# EAGLE design Motor Driver (EAGLE 5.10)
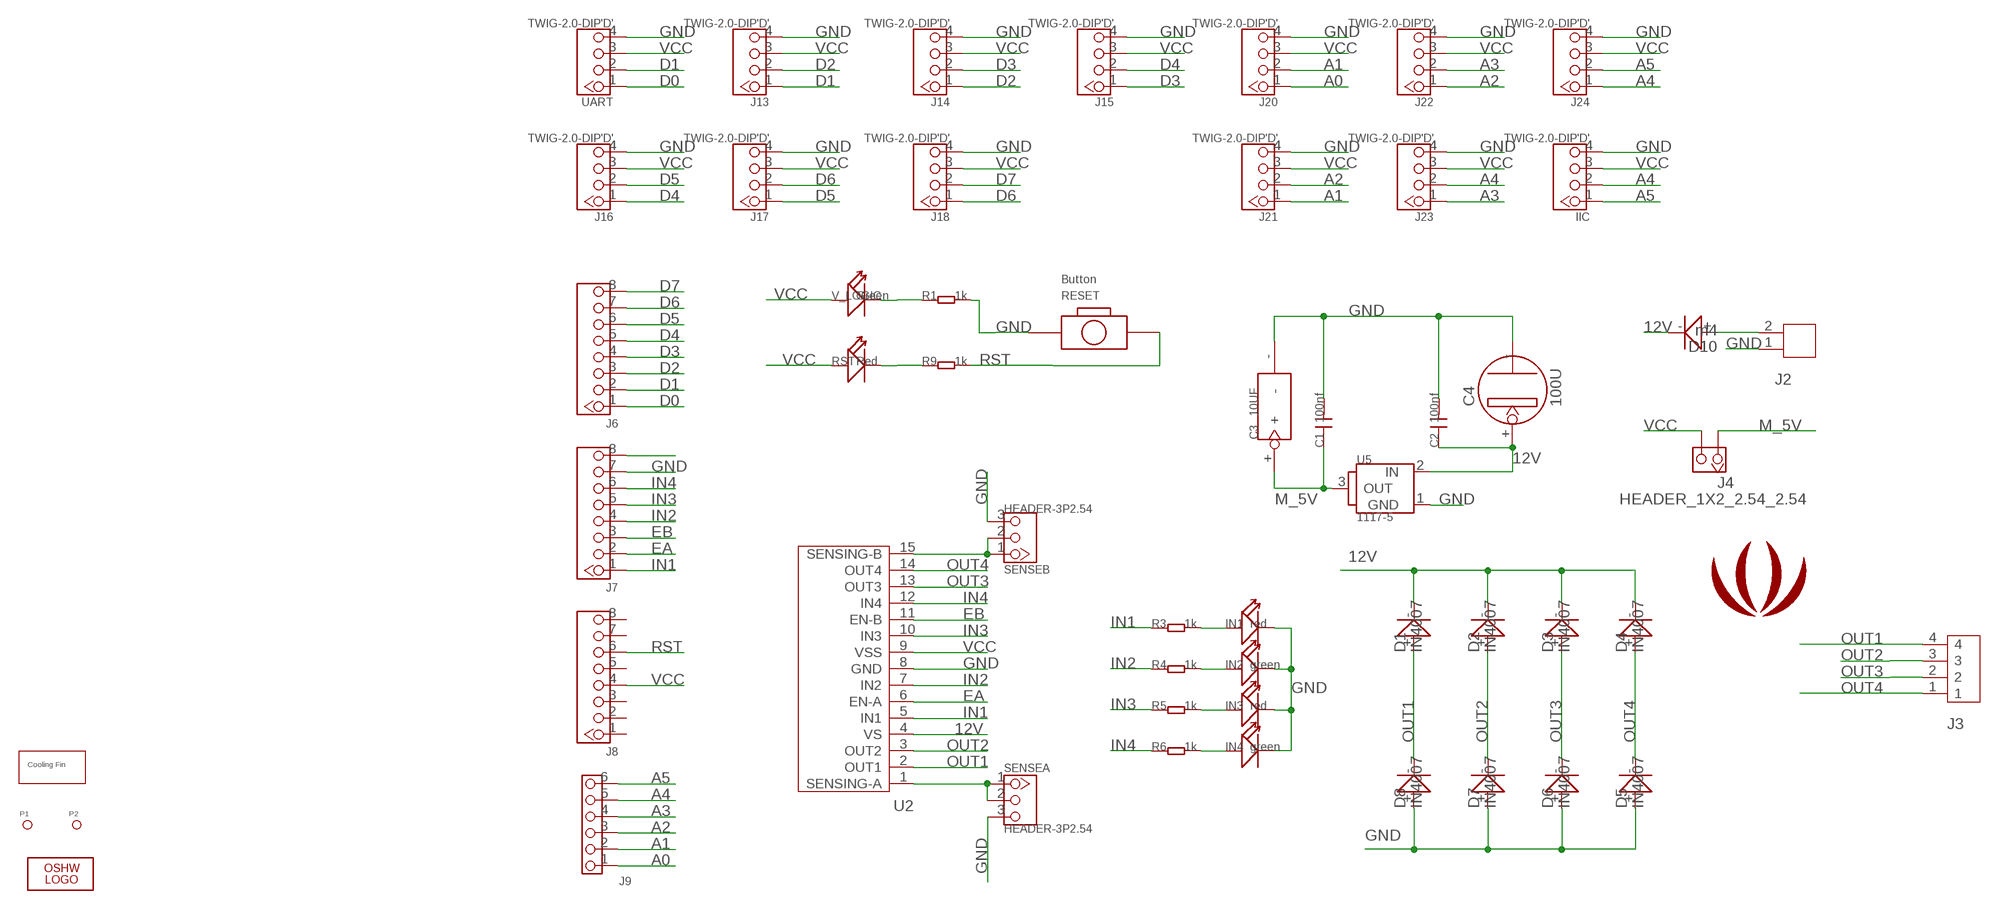
[diagram p0: schematic, sheet 1]

## Parts
C1  100nf  006-C30*35  [0603_S]
C2  100nf  006-C30*35  [0603_S]
C3  10UF  C_TAN_B  [C_TAN_3X3.5]
C4  100U  PANASONIC_D260  [SANYO-OSCON_SMD_C6]
D1  IN4007  010-D2010  [D2010]
D2  IN4007  010-D2010  [D2010]
D3  IN4007  010-D2010  [D2010]
D4  IN4007  010-D2010  [D2010]
D5  IN4007  010-D2010  [D2010]
D6  IN4007  010-D2010  [D2010]
D7  IN4007  010-D2010  [D2010]
D8  IN4007  010-D2010  [D2010]
D10  m4  010-D2010  [D2010]
IIC  TWIG-2.0-DIP'D'  [2.0_1X4_90]
IN1  red  007-LED0603  [D0603]
IN2  green  007-LED0603  [D0603]
IN3  red  007-LED0603  [D0603]
IN4  green  007-LED0603  [D0603]
J2  JST-2P-LEADED'3.36'  [2P-3.36-LEADED-7X7]
J3  JST-4P-3.36-LEADED  [4P-3.36-LEADED-7X14]
J4  HEADER_1X2_2.54_2.54  [65*35]
J6  HEADER-8PSMD  [SMD_8PIN_2.54]
J7  HEADER-8PSMD  [SMD_8PIN_2.54]
J8  HEADER-8PSMD  [SMD_8PIN_2.54]
J9  HEADER-6PSMD  [2.54_6P_SMD]
J13  TWIG-2.0-DIP'D'  [2.0_1X4_90]
J14  TWIG-2.0-DIP'D'  [2.0_1X4_90]
J15  TWIG-2.0-DIP'D'  [2.0_1X4_90]
J16  TWIG-2.0-DIP'D'  [2.0_1X4_90]
J17  TWIG-2.0-DIP'D'  [2.0_1X4_90]
J18  TWIG-2.0-DIP'D'  [2.0_1X4_90]
J20  TWIG-2.0-DIP'D'  [2.0_1X4_90]
J21  TWIG-2.0-DIP'D'  [2.0_1X4_90]
J22  TWIG-2.0-DIP'D'  [2.0_1X4_90]
J23  TWIG-2.0-DIP'D'  [2.0_1X4_90]
J24  TWIG-2.0-DIP'D'  [2.0_1X4_90]
LOGO2  LOGO-OSHW-FILLX0200-NT  [OSHW_FILLX200_NOTEXT]
P1  PAD-MARK  [ROUND-MARK-0.635]
P2  PAD-MARK  [ROUND-MARK-0.635]
R1  1k  005-R0603  [0603-1]
R3  1k  005-R0603  [0603-1]
R4  1k  005-R0603  [0603-1]
R5  1k  005-R0603  [0603-1]
R6  1k  005-R0603  [0603-1]
R9  1k  005-R0603  [0603-1]
RESET  Button  BOTTON-2P-DIP  [2P-LEADED-90-3.56X7.62]
RST  Red  007-LED0603  [D0603]
SENSEA  HEADER-3P2.54  [2.54_1X3P]
SENSEB  HEADER-3P2.54  [2.54_1X3P]
U1  COOLING-FIN  [COOLING-FIN-17X23.8]
U2  L298N-  [MULTIWATT15]
U5  1117-5  [TO252]
U$1  LOGO-SEEEDSTUDIO-SILK  [LOGO_SILK]
UART  TWIG-2.0-DIP'D'  [2.0_1X4_90]
V_LOGIC  Green  007-LED0603  [D0603]

## Nets
12V: C2.1 C4.+ D1.- D2.- D3.- D4.- D10.- U2.4(VS) U5.2(IN)
A0: J9.1 J20.1
A1: J9.2 J20.2 J21.1
A2: J9.3 J21.2 J22.1
A3: J9.4 J22.2 J23.1
A4: IIC.2 J9.5 J23.2 J24.1
A5: IIC.1 J9.6 J24.2
D0: J6.1 UART.1
D1: J6.2 J13.1 UART.2
D2: J6.3 J13.2 J14.1
D3: J6.4 J14.2 J15.1
D4: J6.5 J15.2 J16.1
D5: J6.6 J16.2 J17.1
D6: J6.7 J17.2 J18.1
D7: J6.8 J18.2
EA: J7.2 U2.6(EN-A)
EB: J7.3 U2.11(EN-B)
GND: C1.2 C2.2 C3.- C4.- D5.+ D6.+ D7.+ D8.+ IIC.4 IN1.- IN2.- IN3.- IN4.- J2.1 J7.7 J13.4 J14.4 J15.4 J16.4 J17.4 J18.4 J20.4 J21.4 J22.4 J23.4 J24.4 R1.2 RESET.P$1 SENSEA.3 SENSEB.3 U2.8(GND) U5.1(GND) UART.4
IN1: J7.1 R3.1 U2.5(IN1)
IN2: J7.4 R4.1 U2.7(IN2)
IN3: J7.5 R5.1 U2.10(IN3)
IN4: J7.6 R6.1 U2.12(IN4)
M_5V: C1.1 C3.+ J4.1 U5.3(OUT)
N$1: IN3.+ R5.2
N$3: R1.1 V_LOGIC.-
N$4: SENSEA.1 SENSEA.2 U2.1(SENSING-A)
N$6: D10.+ J2.2
N$10: R9.1 RST.-
N$14: IN1.+ R3.2
N$15: IN2.+ R4.2
N$16: J7.8
N$17: IN4.+ R6.2
N$20: SENSEB.1 SENSEB.2 U2.15(SENSING-B)
OUT1: D1.+ D8.- J3.4 U2.2(OUT1)
OUT2: D2.+ D7.- J3.3 U2.3(OUT2)
OUT3: D3.+ D6.- J3.2 U2.13(OUT3)
OUT4: D4.+ D5.- J3.1 U2.14(OUT4)
RST: J8.6 R9.2 RESET.P$2
VCC: IIC.3 J4.2 J8.4 J13.3 J14.3 J15.3 J16.3 J17.3 J18.3 J20.3 J21.3 J22.3 J23.3 J24.3 RST.+ U2.9(VSS) UART.3 V_LOGIC.+
Unconnected: J8.1 J8.2 J8.3 J8.5 J8.7 J8.8

## Library data of the parts
C1 C2 = Discrete:006-C*: Ceramic Capacitors
C3 = CPT_SMD:C_TAN
C4 = CPT_SMD:PANASONIC_D
D1-D8 D10 = Discrete:010-D*
IIC J13-J18 J20-J24 UART = Connector:TWIG-2.0-DIP
IN1-IN4 RST V_LOGIC = Discrete:007-LED*
J2 = Connector:JST-2P-LEADED
J3 = Connector:JST-4P-3.36-LEADED
J4 = Connector:HEADER_1X2_2.54
J6-J8 = Connector:HEADER-8P
J9 = Connector:HEADER-6P
LOGO2 = Logo:LOGO-OSHW-FILL
P1 P2 = Discreter:PAD-MARK
R1 R3-R6 R9 = Discrete:005-R*
RESET = Discreter:BOTTON-2P
SENSEA SENSEB = Connector:HEADER-3P
U1 = Module:COOLING-FIN
U2 = IC:L298N
U5 = ICs_v54:1117-5
U$1 = Logo:LOGO-SEEEDSTUDIO

## Board
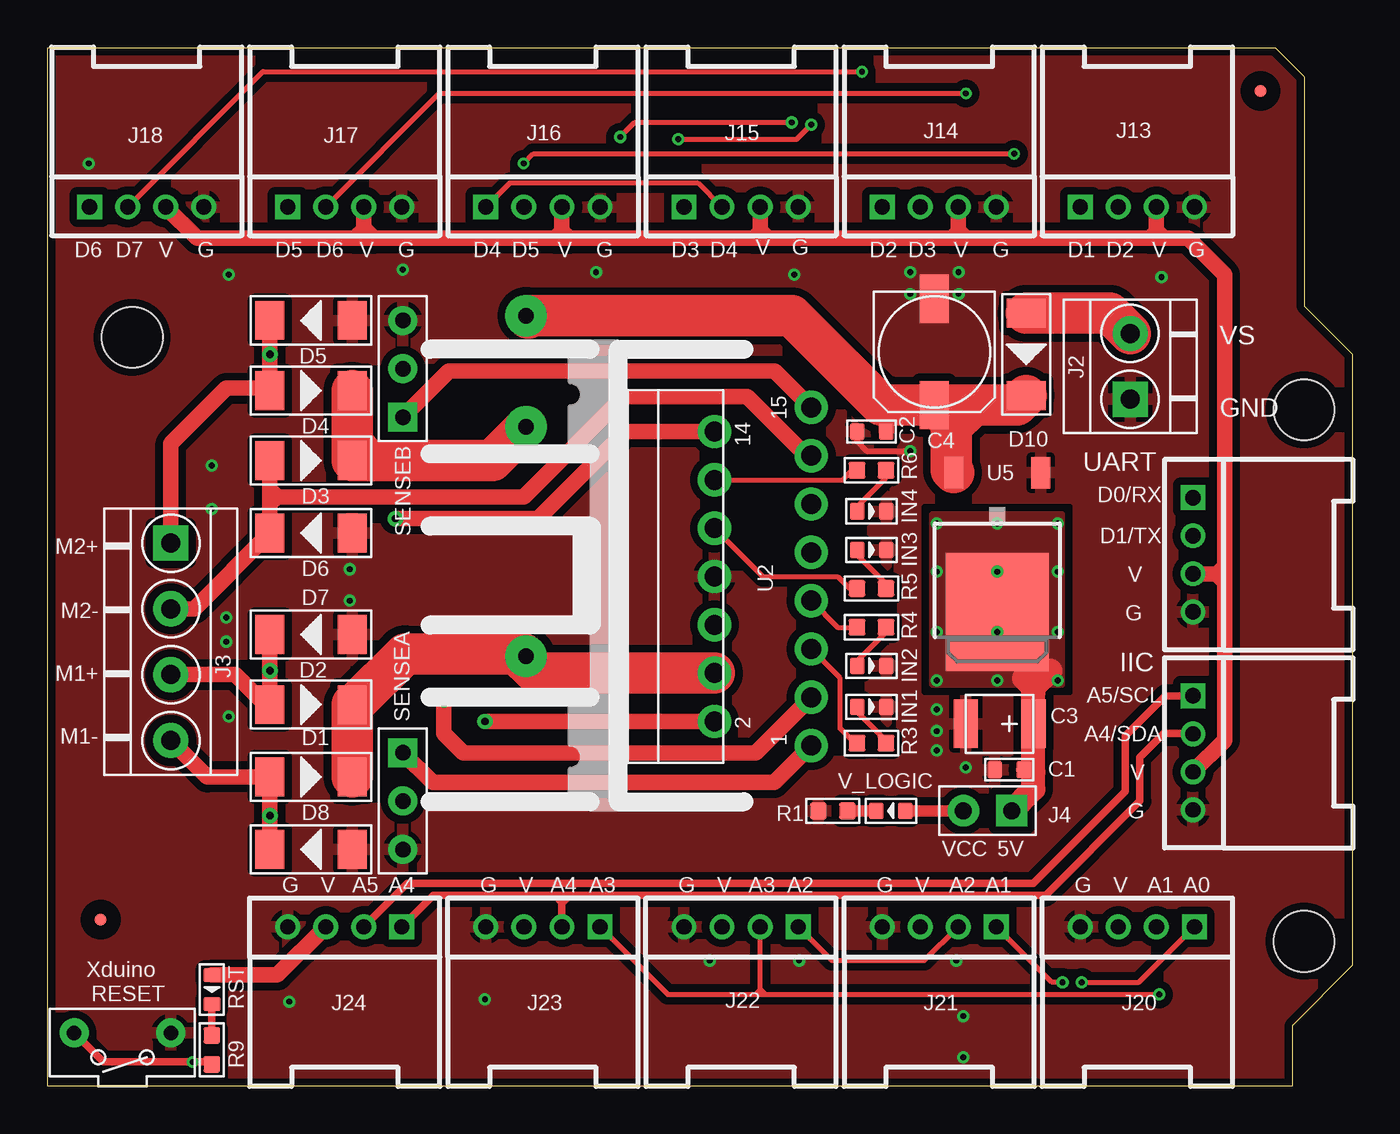
[diagram p1: board, top side]
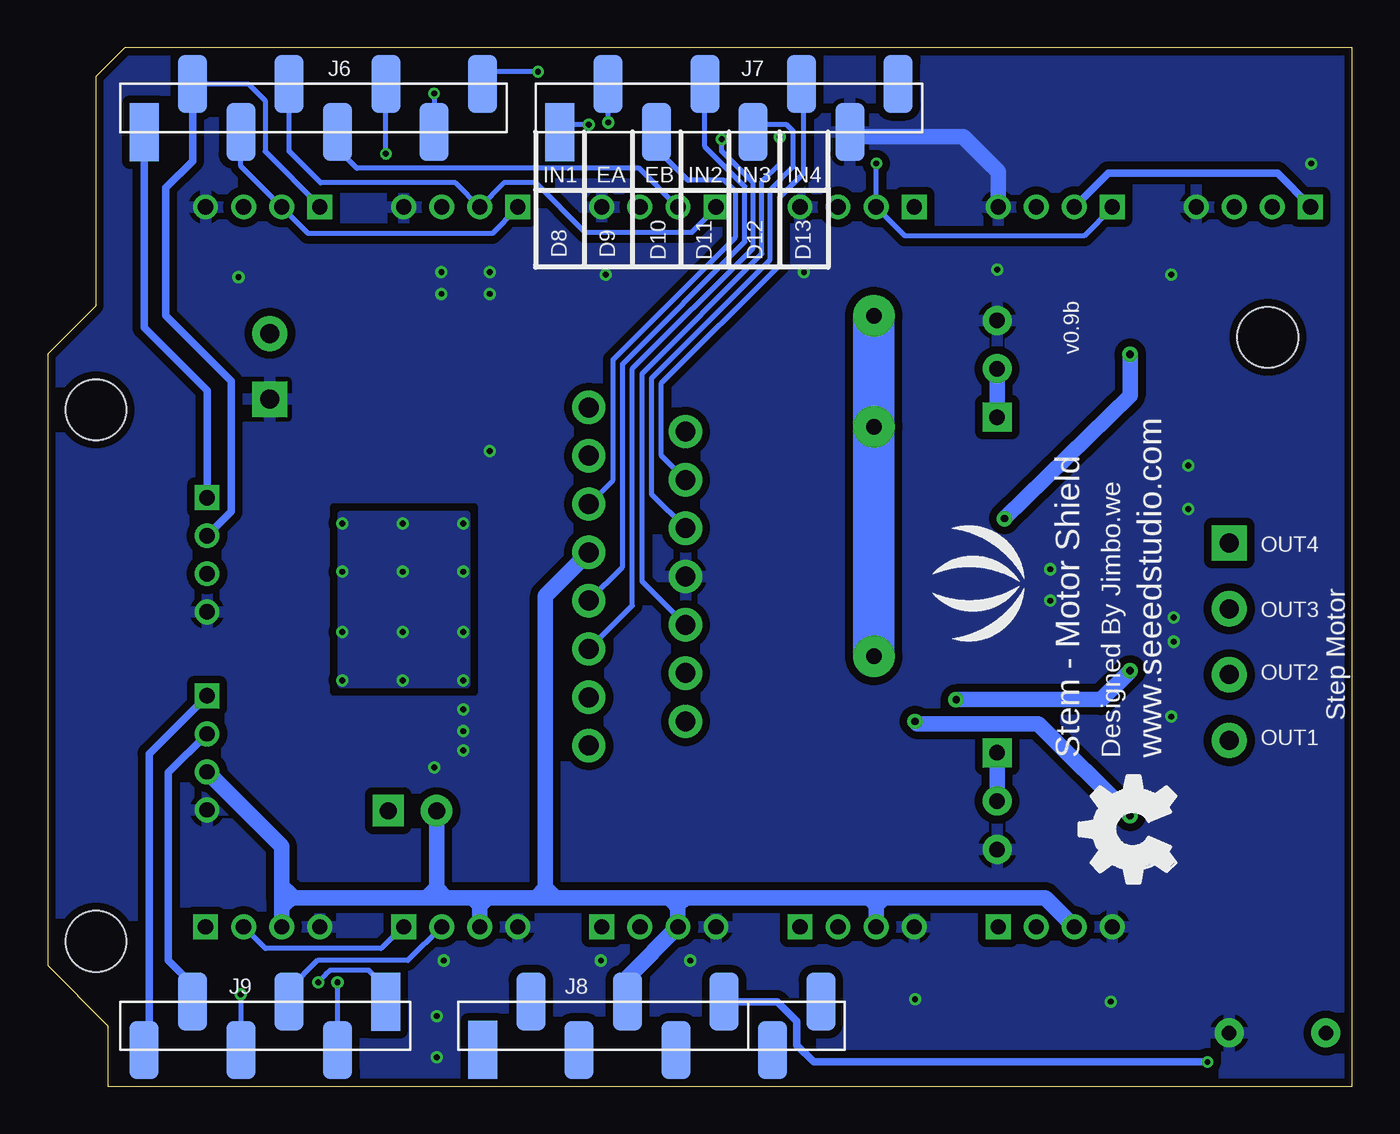
[diagram p2: board, bottom side, seen from below]

Size 68.58 x 54.61 mm. Coordinates in mm from the lower left corner, seen from the top.
Outline: 68.58,6.35 65.41,3.17 65.41,0 0,0 0,54.61 64.52,54.61 66.04,53.09 66.04,41.02 68.58,38.48 68.58,6.35
Copper layers (1*16): Top 0.035mm / dielectric 1.5mm / Bottom 0.035mm
Design rules "SeeedStudio_rule_no_angle_090911": minimum track width 6mil, minimum drill 12mil, track to track 6mil, track to pad 6mil, pad to pad 6mil, via to via 6mil, smd to smd 0mil, copper to edge 10mil, drill to drill 10mil, minimum pad ring 10mil, minimum via ring 6mil, stop-mask expansion 2mil, vias tented up to drill 100mil, thermal gap 10mil
Holes 3.2 mm at 66.04,35.56 66.04,7.62 4.45,39.37

### Footprints (pad centres in the part's own frame; a part is rotated, then mirrored left to right if it is on the bottom)
0603_S = smd 0.762 x 0.889: 1 -0.762,0; 2 0.762,0
C_TAN_3X3.5 = smd 2.54 x 1.27: + 0,1.778; - 0,-1.778
SANYO-OSCON_SMD_C6 = smd 2.54 x 1.524: + 2.794,0; - -2.794,0
D2010 = smd 1.524 x 2.032: + -2.159,0; - 2.159,0
2.0_1X4_90 = drill 0.8 pad 1.27 square: 1 -3,0 | drill 0.8 pad 1.27 round: 2 -1,0; 3 1,0; 4 3,0
D0603 = smd 0.762 x 0.889: + -0.762,0; - 0.762,0
2P-3.36-LEADED-7X7 = drill 1 pad 1.85 square: 1 -1.73,0 | drill 1 pad 1.85 round: 2 1.73,0
4P-3.36-LEADED-7X14 = drill 1 pad 1.85 square: 1 -5.19,0 | drill 1 pad 1.85 round: 2 -1.73,0; 3 1.73,0; 4 5.19,0
65*35 = drill 0.889 pad 1.651 square: 1 0,1.27 | drill 0.889 pad 1.651 round: 2 0,-1.27
SMD_8PIN_2.54 = smd 3.048 x 1.524: 1 -1.27,8.89; 2 1.27,6.35; 3 -1.27,3.81; 4 1.27,1.27; 5 -1.27,-1.27; 6 1.27,-3.81; 7 -1.27,-6.35; 8 1.27,-8.89
2.54_6P_SMD = smd 3.048 x 1.524: 1 -1.27,6.35; 2 1.27,3.81; 3 -1.27,1.27; 4 1.27,-1.27; 5 -1.27,-3.81; 6 1.27,-6.35
ROUND-MARK-0.635 = smd 0.635 x 0.635: P$1 0,0
0603-1 = smd 0.889 x 0.889: 1 -0.762,0; 2 0.762,0
2P-LEADED-90-3.56X7.62 = drill 0.762 pad 1.524 round: P$1 0,2.54; P$2 0,-2.54
2.54_1X3P = drill 0.813 pad 1.524 square: 1 0,2.54 | drill 0.813 pad 1.524 round: 2 0,0; 3 0,-2.54
MULTIWATT15 = drill 1.05 pad 1.75 round: 1 -8.89,0; 2 -7.62,5.08; 3 -6.35,0; 4 -5.08,5.08; 5 -3.81,0; 6 -2.54,5.08; 7 -1.27,0; 8 0,5.08; 9 1.27,0; 10 2.54,5.08; 11 3.81,0; 12 5.08,5.08; 13 6.35,0; 14 7.62,5.08; 15 8.89,0
TO252 = smd 1.016 x 1.651: 1 -2.286,-4.826; 2 2.286,-4.826 | smd 5.4 x 6.2: 3 0,2.5

### Placement (x,y rotation side)
C1  50.55,16.64 180 top
C2  43.31,34.42 180 top
C3  50.04,19.05 270 top
C4  46.61,38.61 270 top
D1  13.84,16.26 0 top
D2  13.84,20.07 0 top
D3  13.84,32.89 0 top
D4  13.84,36.58 0 top
D5  13.84,40.26 180 top
D6  13.84,29.08 180 top
D7  13.84,23.75 180 top
D8  13.84,12.45 180 top
D10  51.44,38.48 270 top
IIC  60.2,17.53 270 top
IN1  43.31,19.94 0 top
IN2  43.31,22.1 0 top
IN3  43.31,28.19 0 top
IN4  43.31,30.23 0 top
J2  56.9,37.85 90 top
J3  6.48,23.37 270 top
J4  49.4,14.48 270 top
J6  54.61,51.44 90 bottom
J7  32.77,51.44 90 bottom
J8  36.83,3.17 90 bottom
J9  57.15,3.17 270 bottom
J13  57.28,46.23 0 top
J14  46.86,46.23 0 top
J15  36.45,46.23 0 top
J16  26.04,46.23 0 top
J17  15.62,46.23 0 top
J18  5.21,46.23 0 top
J20  57.28,8.38 180 top
J21  46.86,8.38 180 top
J22  36.45,8.38 180 top
J23  26.04,8.38 180 top
J24  15.62,8.38 180 top
LOGO2  9.27,10.67 90 bottom
P1  63.75,52.32 0 top
P2  2.79,8.76 0 top
R1  41.27,14.48 180 top
R3  43.31,18.03 0 top
R4  43.31,24.13 0 top
R5  43.31,26.16 0 top
R6  43.31,32.38 0 top
R9  8.64,1.91 270 top
RESET  3.94,2.79 270 top
RST  8.64,5.08 270 top
SENSEA  18.67,14.99 0 top
SENSEB  18.67,37.72 180 top
U1  30,26.85 90 top
U2  40.13,26.8 90 top
U5  49.91,27.43 180 top
U$1  18.92,26.42 90 bottom
UART  60.2,27.94 270 top
V_LOGIC  44.32,14.48 180 top

### Tracks (layer width: path | path; a pad name or v marks a point on that pad's centre or on a via)
12V  (via drill 0.81 pad 2.18)
  Top 0.813: C2.1 44.07,35.56 44.32,35.81
  Top 2.184: D4.- D3.- 16.89,32.89 | D1.- D2.- 16.13,20.07 18.8,22.73 24.64,22.73 | 24.64,22.73 25.02,22.73 v25.15,22.61 | U2.4 25.65,21.72 24.64,22.73 | v25.15,34.67 23.37,32.89 17.14,32.89 16.89,32.89 | 25.27,40.39 v25.15,40.51 39.12,40.51 43.81,35.81 44.32,35.81 C4.+ | 47.5,34.67 47.5,34.92 C4.+ | C4.+ 50.93,35.81 D10.- | U5.2 47.5,32.38 47.5,34.67 | 47.5,34.67 48.51,35.69 | 16.89,32.89 16,33.78
  Bottom 2.184: v25.15,40.51 v25.15,34.67 v25.15,22.61
A0  (via drill 0.3 pad 0.64)
  Top 0.254: v54.36,5.46 57.36,5.46 J20.1
  Bottom 0.254: J9.1 50.8,5.21 51.69,6.1 53.72,6.1 53.98,5.84 v54.36,5.46
A1  (via drill 0.3 pad 0.64)
  Top 0.254: v53.34,5.46 52.78,5.46 J21.1
  Bottom 0.254: J21.1 49.91,8.38 51.05,7.24 57.13,7.24 J20.2 | J9.2 v53.34,5.46
A2
  Top 0.254: J22.1 41.23,6.6 46.09,6.6 J21.2
  Bottom 0.254: J9.3 55.88,5.12 54.4,6.6 49.64,6.6 J21.2
A3  (via drill 0.3 pad 0.64)
  Top 0.254: 37.21,4.83 32.59,4.83 J23.1 | 37.21,4.83 37.47,4.83 | 37.47,4.83 37.72,4.83 | 37.72,4.83 v58.42,4.83 | 37.45,5.06 37.45,4.84 37.47,4.83 | 37.45,5.06 J22.2 | 37.21,4.83 37.45,5.06 | 37.45,5.06 37.48,5.06 37.72,4.83
  Bottom 0.254: v58.42,4.83 J9.4
A4
  Top 0.406: 26.67,10.03 20.27,10.03 J24.1 | 26.67,10.03 26.92,10.03 | 27.04,9.67 27.04,9.92 26.92,10.03 | 26.92,10.03 27.43,10.03 | 27.43,10.03 51.7,10.03 52.45,10.03 57.28,14.86 57.4,14.99 57.4,17.27 58.67,18.54 60.18,18.54 IIC.2 | 27.04,9.67 J23.2 | 26.67,10.03 27.04,9.67 | 27.04,9.67 27.07,9.67 27.43,10.03
  Bottom 0.406: J9.5 60.96,5.33 62.23,6.6 62.23,16.49 IIC.2
A5
  Top 0.406: J24.2 18.91,10.67 50.34,10.67 51.82,10.67 56.64,15.49 56.64,18.41 58.55,20.32 58.75,20.53 IIC.1
  Bottom 0.406: J9.6 63.25,2.16 63.25,17.48 IIC.1
D0
  Bottom 0.406: J6.1 63.5,39.88 60.2,36.58 UART.1
D1
  Bottom 0.254: J13.1 54.28,46.28 57.15,49.15 57.15,51.82 58.04,52.7 J6.2
  Bottom 0.406: J6.2 60.96,48.64 62.36,47.24 62.36,40.51 58.93,37.08 58.93,30.21 UART.2
D2
  Bottom 0.254: J14.1 43.86,46.18 45.21,44.83 54.88,44.83 J13.2 58.42,48.37 J6.3
D3
  Bottom 0.254: J6.4 55.88,49.15 54.23,47.5 47.13,47.5 J14.2 44.59,47.5 42.93,47.5 40.31,44.88 34.74,44.88 33.45,46.18 J15.1
D4
  Top 0.254: J15.2 35.43,46.23 34.16,47.5 24.3,47.5 J16.1
  Bottom 0.254: J6.5 53.34,49.28 52.32,48.26 37.48,48.26 J15.2
D5  (via drill 0.3)
  Top 0.254: v50.8,49.02 25.53,49.02 v25.02,48.51
  Bottom 0.254: J17.1 12.62,46.18 14.1,44.7 23.51,44.7 J16.2 25.04,48.5 v25.02,48.51 | v50.8,49.02 J6.6
D6  (via drill 0.3)
  Top 0.254: J17.2 20.59,52.2 v48.26,52.2
  Bottom 0.254: v48.26,52.2 J6.7
  Bottom 0.406: J18.1 2.21,46.28 3.94,48.01 12.84,48.01 J17.2
D7  (via drill 0.3)
  Top 0.254: v42.8,53.34 11.32,53.34 J18.2
  Bottom 0.254: v42.8,53.34 45.09,53.34 J6.8
EA  (via drill 0.3 pad 0.64)
  Top 0.254: v30.1,49.91 30.86,50.67 v39.12,50.67
  Bottom 0.254: v39.12,50.67 J7.2 | U2.6 37.34,26.54 37.34,37.47 31.03,43.77 31.03,47.58 30.1,48.51 v30.1,49.91
EB
  Bottom 0.254: J7.3 36.58,49.28 34.92,47.62 33.02,47.62 32.42,47.02 32.42,44.65 38.86,38.21 38.86,31.88 U2.11
GND  (via drill 0.3 pad 0.64)
  Top 0.305: C2.2 42.55,33.91 43.05,33.4 v45.34,33.4
  Bottom 0.813: J17.4 18.62,48.09 20.45,49.91 26.16,49.91 J7.7
  other vias: 22.99,4.57 12.7,4.45 15.88,27.18 15.88,25.53 18.67,42.93 9.53,42.67 28.83,42.8 39.24,42.67 8.64,32.64 45.34,42.8 45.34,41.66 47.88,42.8 47.88,41.66 58.55,42.55 2.16,48.51 9.4,23.37 46.74,19.81 46.74,17.65 46.74,18.67 48.26,16.76 8.64,30.35 9.53,19.43 9.4,24.64 47.75,6.6 39.5,6.6 34.8,6.6 48.13,3.68 48.13,1.52
  pour Top (isolate 0.406, rank 6): -1.78,57.78 70.61,57.91 70.61,-2.41 -1.78,-2.54
  pour Bottom (isolate 0.406, rank 6): -1.78,57.78 70.61,57.78 70.61,-2.54 -1.78,-2.54
  pour Top (isolate 0.254, rank 2, no thermals): 44.96,43.18 48.39,43.18 48.39,39.88 44.96,39.88
IN1  (via drill 0.3 pad 0.64)
  Top 0.254: v33.15,49.78 39.37,49.78 v40.13,50.55 | R3.1 42.42,18.03 41.66,18.8 41.66,21.46 U2.5
  Bottom 0.254: U2.5 37.85,25.27 37.85,37.72 31.5,44.07 31.5,47.5 33.15,49.15 v33.15,49.78 | v40.13,50.55 41.27,50.55 J7.1 41.66,50.55
IN2
  Top 0.254: R4.1 41.53,24.13 U2.7
  Bottom 0.254: J7.4 34.04,49.4 31.93,47.3 31.93,44.4 38.35,37.97 38.35,27.3 U2.7
IN3
  Top 0.254: R5.1 42.16,26.16 41.53,26.8 37.59,26.8 U2.10
  Bottom 0.254: 31.5,49.4 J7.5 31.11,50.55 29.72,50.55 29.38,50.21 29.38,48.34 30.61,47.12 30.61,43.45 36.83,37.22 36.83,31.11 U2.10
IN4
  Top 0.254: R6.1 42.29,32.38 41.78,31.88 U2.12
  Bottom 0.254: J7.6 28.83,52.58 28.83,48.01 30.1,46.74 30.1,43.18 36.32,36.96 36.32,33.15 U2.12
M_5V  (via drill 0.3 pad 0.64)
  Top 0.813: v49.91,23.88 50.04,23.75 | C1.1 51.69,16.64 51.82,16.51
  Top 1.27: 51.82,20.95 51.82,21.97 v49.91,23.88 | J4.1 51.82,15.62 51.82,16.51 C3.+ 51.82,20.7 51.82,20.95 | 51.82,20.95 51.31,21.46 | 51.82,20.95 52.7,21.84
  other vias: 46.74,21.34 49.91,21.34 53.09,21.34 46.74,23.88 46.74,27.05 46.74,29.59 49.91,27.05 49.91,29.59 53.09,29.59 53.09,27.05 53.09,23.88
  pour Top (isolate 0.254, no thermals): 46.48,30.1 53.34,30.1 53.34,21.08 46.48,21.08
  pour Bottom (isolate 0.254, no thermals): 46.48,30.1 53.21,30.1 53.21,21.08 46.48,21.08
N$1
  Top 0.254: IN3.+ 42.55,27.94 44.07,26.42 R5.2
N$3
  Top 0.61: R1.1 V_LOGIC.-
N$4
  Top 0.813: U2.1 38.19,15.96 22.19,15.96 20.23,15.96 SENSEA.1
  Bottom 0.813: SENSEA.2 SENSEA.1
N$6
  Top 2.184: D10.+ 55.83,40.64 J2.2
N$10
  Top 0.406: R9.1 RST.-
N$14
  Top 0.254: 42.55,20.19 IN1.+ 42.55,19.68 44.07,18.16 R3.2
N$15
  Top 0.254: IN2.+ 42.55,22.35 44.07,23.88 R4.2
N$17
  Top 0.254: R6.2 44.07,32 42.55,30.48 IN4.+
N$20
  Top 0.813: U2.15 38.23,37.59 25.78,37.59 21.34,37.59 21.08,37.59 SENSEB.1
  Bottom 0.813: SENSEB.1 SENSEB.2
OUT1  (via drill 0.38 pad 0.81)
  Top 0.813: D8.- v11.68,14.22 D1.+ 8.4,16.26 J3.4 | v22.99,19.18 U2.2
  Bottom 0.813: v22.99,19.18 22.86,19.05 16.51,19.05 v11.68,14.22
OUT2  (via drill 0.38 pad 0.81)
  Top 0.813: U2.3 37.21,17.53 21.84,17.53 20.83,18.54 v20.83,20.32 | D7.- v11.68,21.84 D2.+ 11.43,20.07 9.86,21.64 J3.3
  Bottom 0.813: v20.83,20.32 13.21,20.32 v11.68,21.84
OUT3
  Top 0.813: 11.68,30.61 D6.- 7.7,25.1 J3.2 | 11.68,30.61 11.68,31.11 | 11.68,31.11 11.68,32.77 D3.+ | U2.13 39.88,33.15 36.77,36.26 30.29,36.26 25.02,30.99 12.06,30.99 | 12.06,30.99 11.81,30.99 11.68,31.11 | 12.06,30.99 11.81,31.24 | 11.68,30.61 12.06,30.99
OUT4  (via drill 0.38 pad 0.81)
  Top 0.813: 11.68,36.7 v11.68,38.48 | 11.68,36.7 D4.+ | U2.14 30.35,34.42 25.78,29.84 v18.29,29.84 | 11.68,39.75 D5.- 11.56,39.75 11.68,39.75 | v11.68,38.48 11.68,39.75 | v11.68,38.48 11.68,39.75 | 11.68,39.75 11.56,39.88 | 11.68,36.7 9.4,36.7 6.48,33.78 J3.1
  Bottom 0.813: v18.29,29.84 11.68,36.32 11.68,38.35 v11.68,38.48
RST  (via drill 0.3)
  Top 0.406: R9.2 8.51,1.27 v7.62,1.27 2.92,1.27 RESET.P$2
  Bottom 0.406: 33.02,5.33 J8.6 30.23,4.45 29.21,3.42 29.21,2.16 28.32,1.27 v7.62,1.27
VCC
  Top 0.61: V_LOGIC.+ 46.35,14.48 J4.2
  Top 0.813: J18.3 6.22,46.23 7.87,44.58 16.13,44.58 | 47.86,44.97 47.86,44.59 47.88,44.58 | 16.51,44.58 16.13,44.58 | 17.14,44.58 16.51,44.58 | 26.67,44.58 17.14,44.58 | 26.92,44.58 26.67,44.58 | 37.85,44.58 37.72,44.58 | 47.88,44.58 47.5,44.58 | 16.62,45.07 16.62,44.69 16.51,44.58 | 27.04,44.94 27.04,44.69 26.92,44.58 | 37.45,44.94 37.45,44.85 37.72,44.58 | RST.+ 12.08,5.84 J24.3 | 27.43,44.58 26.92,44.58 | 37.08,44.58 27.43,44.58 | 37.72,44.58 37.08,44.58 | 48.26,44.58 47.88,44.58 | 57.91,44.58 48.26,44.58 | 58.29,44.58 57.91,44.58 | 58.67,44.58 58.29,44.58 | 58.67,44.58 59.94,44.58 61.86,42.66 61.86,26.67 | 61.86,26.67 61.86,18.19 IIC.3 | 61.48,26.94 61.59,26.94 61.86,26.67 | 61.45,26.94 UART.3 | 61.45,26.94 61.85,26.54 | 61.48,26.94 61.45,26.94 | 61.48,26.94 61.85,27.3 | 58.28,44.94 58.28,44.59 58.29,44.58 | 58.28,44.97 58.28,44.94 | 58.28,44.94 57.91,44.58 | 58.28,44.97 J13.3 | 58.67,44.58 58.28,44.97 | 47.86,44.97 J14.3 | 48.26,44.58 47.88,44.96 | 47.88,44.96 47.86,44.97 | 47.5,44.58 37.85,44.58 | 47.88,44.96 47.5,44.58 | 37.45,44.97 J15.3 | 37.85,44.58 37.45,44.97 | 37.45,44.97 37.45,44.94 | 37.45,44.94 37.08,44.58 | 27.04,44.97 J16.3 | 27.43,44.58 27.04,44.97 | 27.04,44.97 27.04,44.94 | 27.04,44.94 26.67,44.58 | 16.62,45.1 J17.3 | 17.14,44.58 16.62,45.1 | 16.62,45.1 16.62,45.07 | 16.62,45.07 16.13,44.58
  Bottom 0.813: 24.64,9.91 16.14,9.91 J24.3 | 24.64,9.91 25.02,9.91 | 25.02,9.91 25.4,9.91 | 25.4,9.91 35.05,9.91 | 35.05,9.91 35.43,9.91 | 35.43,9.91 42.29,9.91 | 42.29,9.91 42.93,9.91 | 42.93,9.91 45.47,9.91 | 45.47,9.91 45.85,9.91 | 45.85,9.91 46.23,9.91 | 55.75,9.91 56.26,9.91 56.28,9.89 | 56.28,9.89 J20.3 | J8.4 38.1,5.71 35.45,8.37 J22.3 35.45,9.41 | 45.86,9.54 45.86,9.89 45.85,9.91 | 35.45,9.51 35.45,9.89 35.43,9.91 | U2.9 42.42,25.78 42.42,10.41 | 42.42,10.41 42.42,10.03 42.29,9.91 | 35.45,9.51 35.45,9.41 | 35.05,9.91 35.45,9.51 | 35.45,9.41 35.81,9.78 | 42.93,9.91 42.42,10.41 | 42.42,10.41 42.04,10.03 | 45.86,9.51 J21.3 | 45.47,9.91 45.86,9.51 | 45.86,9.51 45.86,9.54 | 45.86,9.54 46.23,9.91 | 55.75,9.91 55.75,10.03 56.26,10.54 | 46.23,9.91 47.62,9.91 | 47.62,9.91 48.26,9.91 | 48.26,9.91 48.64,9.91 | 48.64,9.91 55.75,9.91 | 55.75,9.91 56.13,9.53 | 48.13,10.41 48.13,10.03 48.26,9.91 | 56.28,9.89 56.28,12.61 IIC.3 | 48.13,10.41 J4.2 | 48.13,10.41 48.64,9.91 | 47.62,9.91 48.13,10.41 | 25.04,9.54 25.04,9.89 25.02,9.91 | 25.04,9.51 J23.3 | 24.64,9.91 25.04,9.51 | 25.04,9.51 25.04,9.54 | 25.04,9.54 25.4,9.91

### Text on the board
tPlace: D6 | D7 | V | G | D5 | D6 | V | G | D4 | D5 | V | G | D3 | D4 | V | G | D2 | D3 | V | G | D1 | D2 | V | G | VS | GND | 14 | D0/RX | M2+ | D1/TX | V | M2- | G | M1+ | A5/SCL | M1- | 2 | A4/SDA | V | G | VCC | 5V | G | V | A5 | A4 | G | V | A4 | A3 | G | V | A3 | A2 | G | V | A2 | A1 | G | V | A1 | A0 | Xduino
bPlace: IN4 | IN3 | IN2 | EB | EA | IN1 | D9 | D8 | D13 | D12 | D11 | D10 | v0.9b | OUT4 | OUT3 | OUT2 | Step Motor | OUT1 | www.seeedstudio.com | Designed By Jimbo.we | Stem - Motor Shield